# EAGLE design ledboard (EAGLE 7.6.0)
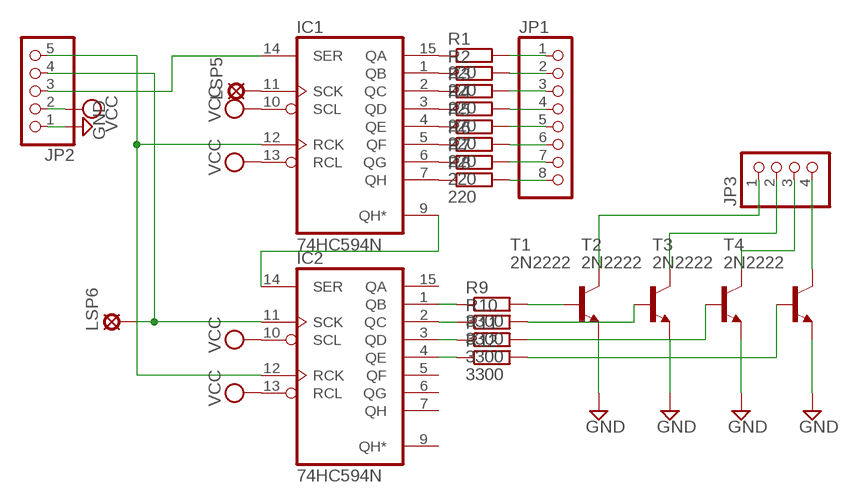
[diagram p0: schematic, sheet 1]

## Parts
IC1  74HC594N  [DIL16]
IC2  74HC594N  [DIL16]
JP1  PINHD-1X8  [1X08]
JP2  PINHD-1X5  [1X05]
JP3  PINHD-1X4  [1X04]
LSP5  LSP10  [LSP10]
LSP6  LSP10  [LSP10]
R1  220  R-EU_0207/10  [0207/10]
R2  220  R-EU_0207/10  [0207/10]
R3  220  R-EU_0207/10  [0207/10]
R4  220  R-EU_0207/10  [0207/10]
R5  220  R-EU_0207/10  [0207/10]
R6  220  R-EU_0207/10  [0207/10]
R7  220  R-EU_0207/10  [0207/10]
R8  220  R-EU_0207/10  [0207/10]
R9  3300  R-EU_0207/10  [0207/10]
R10  3300  R-EU_0207/10  [0207/10]
R11  3300  R-EU_0207/10  [0207/10]
R12  3300  R-EU_0207/10  [0207/10]
T1  2N2222  [TO92-EBC-OVAL]
T2  2N2222  [TO92-EBC-OVAL]
T3  2N2222  [TO92-EBC-OVAL]
T4  2N2222  [TO92-EBC-OVAL]

## Nets
GND: JP2.1 T1.E T2.E T3.E T4.E
N$1: IC1.14(SER) JP2.3
N$3: IC1.11(SCK) LSP5.MP
N$4: IC1.15(QA) R1.1
N$5: IC1.1(QB) R2.1
N$6: IC1.2(QC) R3.1
N$7: IC1.3(QD) R4.1
N$8: IC1.4(QE) R5.1
N$9: IC1.5(QF) R6.1
N$10: IC1.6(QG) R7.1
N$11: IC1.7(QH) R8.1
N$12: IC2.3(QD) R11.1
N$13: IC2.2(QC) R10.1
N$14: IC2.1(QB) R9.1
N$15: IC2.4(QE) R12.1
N$16: R9.2 T1.B
N$17: R10.2 T2.B
N$18: R11.2 T3.B
N$19: R12.2 T4.B
N$20: JP1.1 R1.2
N$21: JP1.2 R2.2
N$22: JP1.3 R3.2
N$23: JP1.4 R4.2
N$24: JP1.5 R5.2
N$25: JP1.6 R6.2
N$26: JP1.7 R7.2
N$27: JP1.8 R8.2
N$28: JP3.1 T1.C
N$29: JP3.2 T2.C
N$30: JP3.3 T3.C
N$31: JP3.4 T4.C
N$32: IC2.11(SCK) JP2.4 LSP6.MP
N$33: IC1.12(RCK) IC2.12(RCK) JP2.5
N$38: IC1.9(QH*) IC2.14(SER)
VCC: IC1.10(SCL) IC1.13(RCL) IC2.10(SCL) IC2.13(RCL) JP2.2
Unconnected: IC2.5(QF) IC2.6(QG) IC2.7(QH) IC2.9(QH*) IC2.15(QA)

## Power pins joined to a net without a drawn wire
GND: IC1.8(GND) IC2.8(GND)
VCC: IC1.16(VCC) IC2.16(VCC)

## Library data of the parts
IC1 IC2 = 74xx-eu:74*594: 8-bit SHIFT REGISTER, output latch
JP1 = pinhead:PINHD-1X8: PIN HEADER
JP2 = pinhead:PINHD-1X5: PIN HEADER
JP3 = pinhead:PINHD-1X4: PIN HEADER
LSP5 LSP6 = solpad:LSP10: SOLDER PAD drill 1.0 mm, distributor Buerklin, 12H555
R1-R12 = resistor:R-EU_: RESISTOR, European symbol
T1-T4 = adafruit:2N2222: NPN TRANSISTOR Big oval pads

## Board
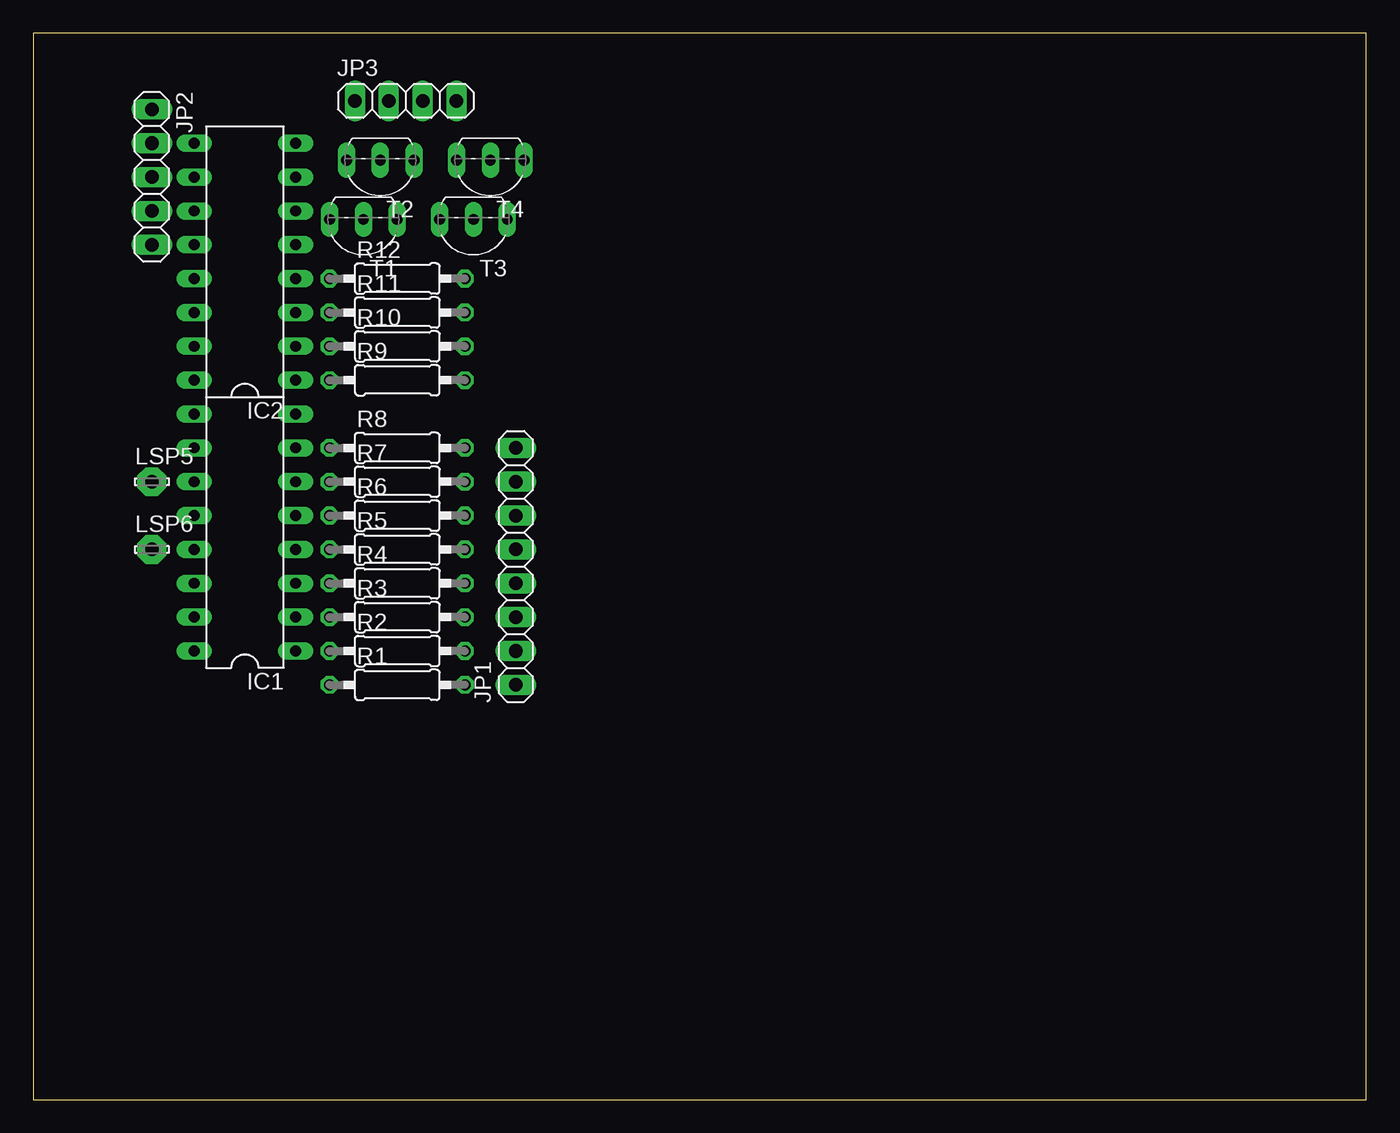
[diagram p1: board, top side]
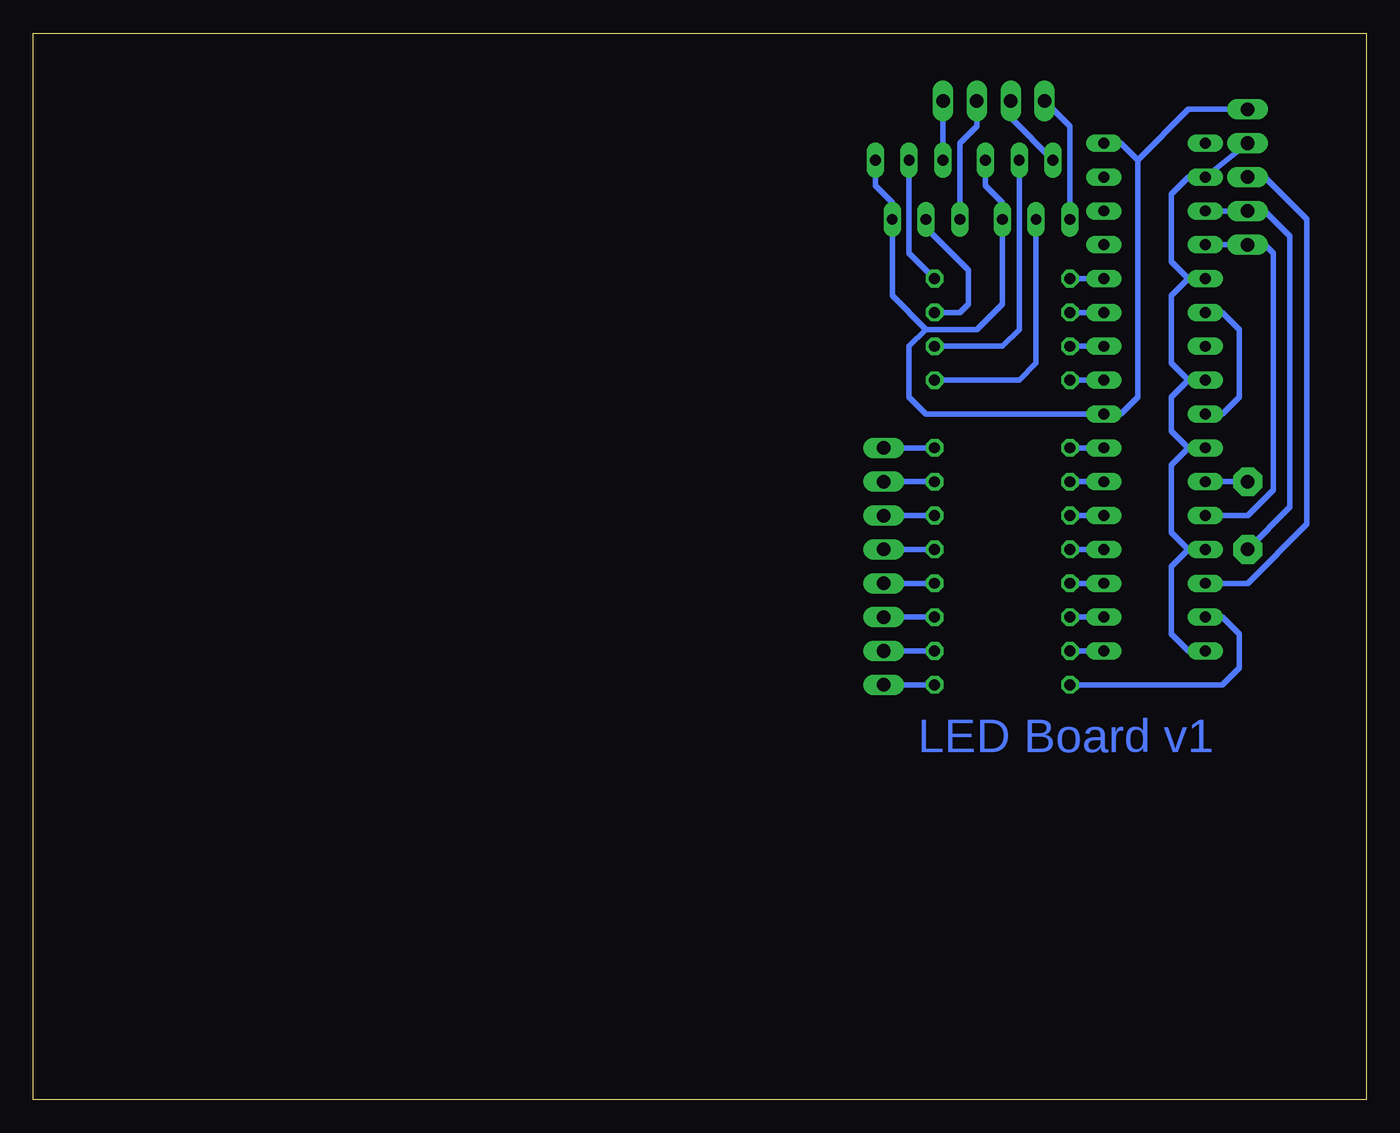
[diagram p2: board, bottom side, seen from below]

Size 100 x 80 mm. Coordinates in mm from the lower left corner, seen from the top.
Outline: 0,0 100,0 100,80 0,80 0,0
Copper layers (1*16): Top 0.035mm / dielectric 1.5mm / Bottom 0.035mm
Design rules "default": minimum track width 10mil, minimum drill 24mil, track to track 8mil, track to pad 8mil, pad to pad 8mil, via to via 8mil, smd to smd 8mil, copper to edge 40mil, drill to drill 8mil, minimum pad ring 10mil, minimum via ring 8mil, stop-mask expansion 4mil, vias tented up to drill 0mil, thermal gap 10mil

### Footprints (pad centres in the part's own frame; a part is rotated, then mirrored left to right if it is on the bottom)
DIL16 = drill 0.813 long: 1 -8.89,-3.81; 2 -6.35,-3.81; 3 -3.81,-3.81; 4 -1.27,-3.81; 5 1.27,-3.81; 6 3.81,-3.81; 7 6.35,-3.81; 8 8.89,-3.81; 9 8.89,3.81; 10 6.35,3.81; 11 3.81,3.81; 12 1.27,3.81; 13 -1.27,3.81; 14 -3.81,3.81; 15 -6.35,3.81; 16 -8.89,3.81
1X08 = drill 1.016 long: 1 -8.89,0; 2 -6.35,0; 3 -3.81,0; 4 -1.27,0; 5 1.27,0; 6 3.81,0; 7 6.35,0; 8 8.89,0
1X05 = drill 1.016 long: 1 -5.08,0; 2 -2.54,0; 3 0,0; 4 2.54,0; 5 5.08,0
1X04 = drill 1.016 long: 1 -3.81,0; 2 -1.27,0; 3 1.27,0; 4 3.81,0
LSP10 = drill 1.016 pad 2.159 octagon: MP 0,0
0207/10 = drill 0.813 octagon: 1 -5.08,0; 2 5.08,0
TO92-EBC-OVAL = drill 0.813 long: B 0,-1.27; C 2.54,-1.27; E -2.54,-1.27

### Placement (x,y rotation side)
IC1  15.88,42.55 90 top
IC2  15.88,62.87 90 top
JP1  36.2,40.01 90 top
JP2  8.89,69.22 270 top
JP3  27.94,74.93 0 top
LSP5  8.89,46.35 0 top
LSP6  8.89,41.27 0 top
R1  27.3,31.11 0 top
R2  27.3,33.66 0 top
R3  27.3,36.2 0 top
R4  27.3,38.73 0 top
R5  27.3,41.27 0 top
R6  27.3,43.81 0 top
R7  27.3,46.35 0 top
R8  27.3,48.9 0 top
R9  27.3,53.98 0 top
R10  27.3,56.52 0 top
R11  27.3,59.05 0 top
R12  27.3,61.59 0 top
T1  24.77,64.77 180 top
T2  26.04,69.22 180 top
T3  33.02,64.77 180 top
T4  34.29,69.22 180 top

### Tracks (layer width: path | path; a pad name or v marks a point on that pad's centre or on a via)
GND
  Bottom 0.406: 17.14,70.48 17.14,52.7 18.41,51.44 IC1.8 33.02,51.44 34.29,52.7 34.29,56.52 33.02,57.78 | T2.E 28.57,68.58 27.3,67.31 T1.E 27.3,59.69 29.21,57.78 33.02,57.78 | T4.E 36.83,68.58 35.56,67.31 T3.E 35.56,60.33 33.02,57.78 | JP2.1 13.34,74.3 17.14,70.48 | IC2.8 18.41,71.75 17.14,70.48
N$1
  Bottom 0.406: IC1.14 8.89,38.73 4.45,43.18 4.45,66.04 7.62,69.22 JP2.3
N$3
  Bottom 0.406: LSP5.MP IC1.11
N$4
  Bottom 0.406: R1.1 10.79,31.11 9.53,32.38 9.53,34.92 10.79,36.2 IC1.15
N$5
  Bottom 0.406: IC1.1 R2.1
N$6
  Bottom 0.406: IC1.2 R3.1
N$7
  Bottom 0.406: IC1.3 R4.1
N$8
  Bottom 0.406: IC1.4 R5.1
N$9
  Bottom 0.406: IC1.5 R6.1
N$10
  Bottom 0.406: IC1.6 R7.1
N$11
  Bottom 0.406: IC1.7 R8.1
N$12
  Bottom 0.406: IC2.3 R11.1
N$13
  Bottom 0.406: IC2.2 R10.1
N$14
  Bottom 0.406: IC2.1 R9.1
N$15
  Bottom 0.406: R12.1 IC2.4
N$16
  Bottom 0.406: R9.2 26.04,53.98 24.77,55.24 T1.B
N$17
  Bottom 0.406: R10.2 27.3,56.52 26.04,57.78 T2.B
N$18
  Bottom 0.406: R11.2 30.48,59.05 29.84,59.69 29.84,62.23 33.02,65.41 T3.B
N$19
  Bottom 0.406: R12.2 34.29,63.5 T4.B
N$20
  Bottom 0.406: R1.2 JP1.1
N$21
  Bottom 0.406: R2.2 JP1.2
N$22
  Bottom 0.406: R3.2 JP1.3
N$23
  Bottom 0.406: R4.2 JP1.4
N$24
  Bottom 0.406: R5.2 JP1.5
N$25
  Bottom 0.406: R6.2 JP1.6
N$26
  Bottom 0.406: R7.2 JP1.7
N$27
  Bottom 0.406: R8.2 JP1.8
N$28
  Bottom 0.406: JP3.1 22.23,73.03 T1.C
N$29
  Bottom 0.406: T2.C 26.67,73.66 JP3.2
N$30
  Bottom 0.406: T3.C 30.48,71.75 29.21,73.03 JP3.3
N$31
  Bottom 0.406: T4.C JP3.4
N$32
  Bottom 0.406: IC2.11 JP2.4 7.62,66.67 5.71,64.77 5.71,44.45 LSP6.MP
N$33
  Bottom 0.406: IC2.12 JP2.5 7.62,64.14 6.99,63.5 6.99,45.72 8.89,43.81 IC1.12
N$38
  Bottom 0.406: IC1.9 10.79,51.44 9.53,52.7 9.53,57.78 10.79,59.05 IC2.14
VCC
  Bottom 0.406: JP2.2 IC2.10 13.34,69.22 14.61,67.94 14.61,62.87 13.34,61.59 | IC2.13 13.34,61.59 | 13.34,61.59 14.61,60.33 14.61,55.24 13.34,53.98 | IC2.16 13.34,53.98 | 13.34,53.98 14.61,52.7 14.61,50.16 13.34,48.9 | IC1.10 13.34,48.9 | 13.34,48.9 14.61,47.62 14.61,42.55 13.34,41.27 | IC1.13 13.34,41.27 | 13.34,41.27 14.61,40.01 14.61,34.92 13.34,33.66 IC1.16

### Text on the board
Bottom: LED Board v1